# Altium schematic sheet testpoints.SchDoc
size A4
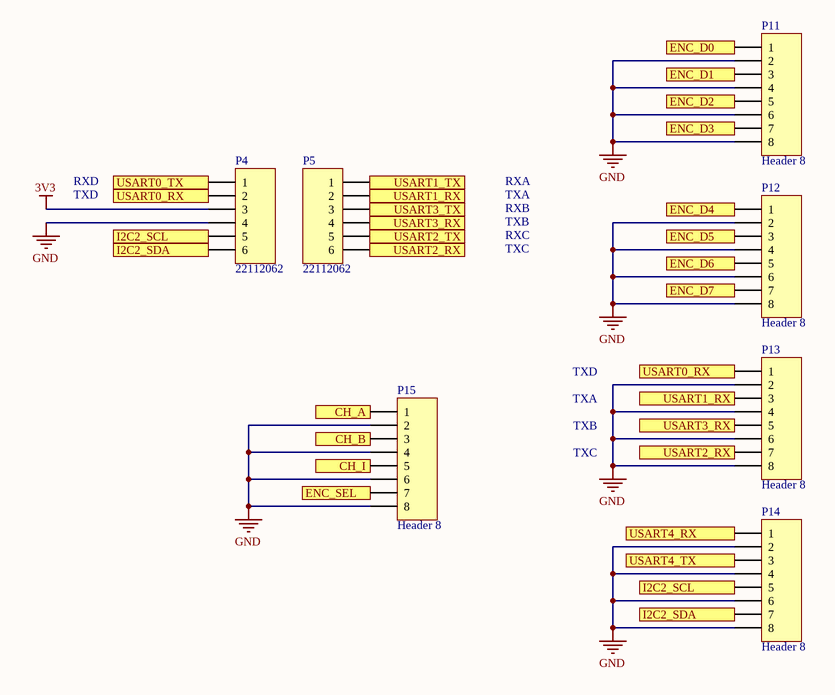
[diagram p0: testpoints.SchDoc]

## Parts
P4  Manufacturer Part Number: 22112062  [MOLX-22112062]  (hidden comment: Header 6)
P5  Manufacturer Part Number: 22112062  [MOLX-22112062]  (hidden comment: Header 6)
P11  Header 8  [MOLX-530470810]
P12  Header 8  [MOLX-530470810]
P13  Header 8  [MOLX-530470810]
P14  Header 8  [MOLX-530470810]
P15  Header 8  [MOLX-530470810]

## Ports
CH_A, CH_B, CH_I, ENC_D0, ENC_D1, ENC_D2, ENC_D3, ENC_D4, ENC_D5, ENC_D6, ENC_D7, ENC_SEL, I2C2_SCL, I2C2_SDA, USART0_RX, USART0_TX, USART1_RX, USART1_TX, USART2_RX, USART2_TX, USART3_RX, USART3_TX, USART4_RX, USART4_TX

## Nets
3V3: P4.3
GND: P4.4 P11.2 P11.4 P11.6 P11.8 P12.2 P12.4 P12.6 P12.8 P13.2 P13.4 P13.6 P13.8 P14.2 P14.4 P14.6 P14.8 P15.2 P15.4 P15.6 P15.8
CH_A: P15.1 ; port CH_A
CH_B: P15.3 ; port CH_B
CH_I: P15.5 ; port CH_I
ENC_D0: P11.1 ; port ENC_D0
ENC_D1: P11.3 ; port ENC_D1
ENC_D2: P11.5 ; port ENC_D2
ENC_D3: P11.7 ; port ENC_D3
ENC_D4: P12.1 ; port ENC_D4
ENC_D5: P12.3 ; port ENC_D5
ENC_D6: P12.5 ; port ENC_D6
ENC_D7: P12.7 ; port ENC_D7
ENC_SEL: P15.7 ; port ENC_SEL
I2C2_SCL: P4.5 P14.5 ; port I2C2_SCL
I2C2_SDA: P4.6 P14.7 ; port I2C2_SDA
USART0_RX: P4.2 P13.1 ; port USART0_RX
USART0_TX: P4.1 ; port USART0_TX
USART1_RX: P5.2 P13.3 ; port USART1_RX
USART1_TX: P5.1 ; port USART1_TX
USART2_RX: P5.6 P13.7 ; port USART2_RX
USART2_TX: P5.5 ; port USART2_TX
USART3_RX: P5.4 P13.5 ; port USART3_RX
USART3_TX: P5.3 ; port USART3_TX
USART4_RX: P14.1 ; port USART4_RX
USART4_TX: P14.3 ; port USART4_TX

## Notes on the sheet
- RXD
- TXD
- RXA
- TXA
- RXB
- TXB
- RXC
- TXC

## Library data of the parts
P4 P5 = 36: CONN HEADER 6POS .100 VERT GOLD; Part Number: 36; Designator: P?; LatestRevisionDate: 17-Jul-2002; LatestRevisionNote: Re-released for DXP Platform.; Publisher: Altium Limited; Supplier Part Number 1: WM2704-ND; Supplier 1: Digi-Key; Supplier Link: http://www.digikey.ca/product-search/en?keywords=WM2704-ND; PackageReference: MOLX-22112062
P11-P15 = 12: CONN HEADER 8POS 1.25MM VERT TIN; Part Number: 12; Manufacturer Part Number: 530470810; Designator: P?; LatestRevisionDate: 17-Jul-2002; LatestRevisionNote: Re-released for DXP Platform.; Publisher: Altium Limited; Supplier Part Number 1: WM1737-ND; Supplier 1: Digi-Key; Supplier Link: http://www.digikey.ca/product-search/en?keywords=WM1737-ND; PackageReference: MOLX-530470810